# EAGLE design lmkbd (EAGLE 4.15)
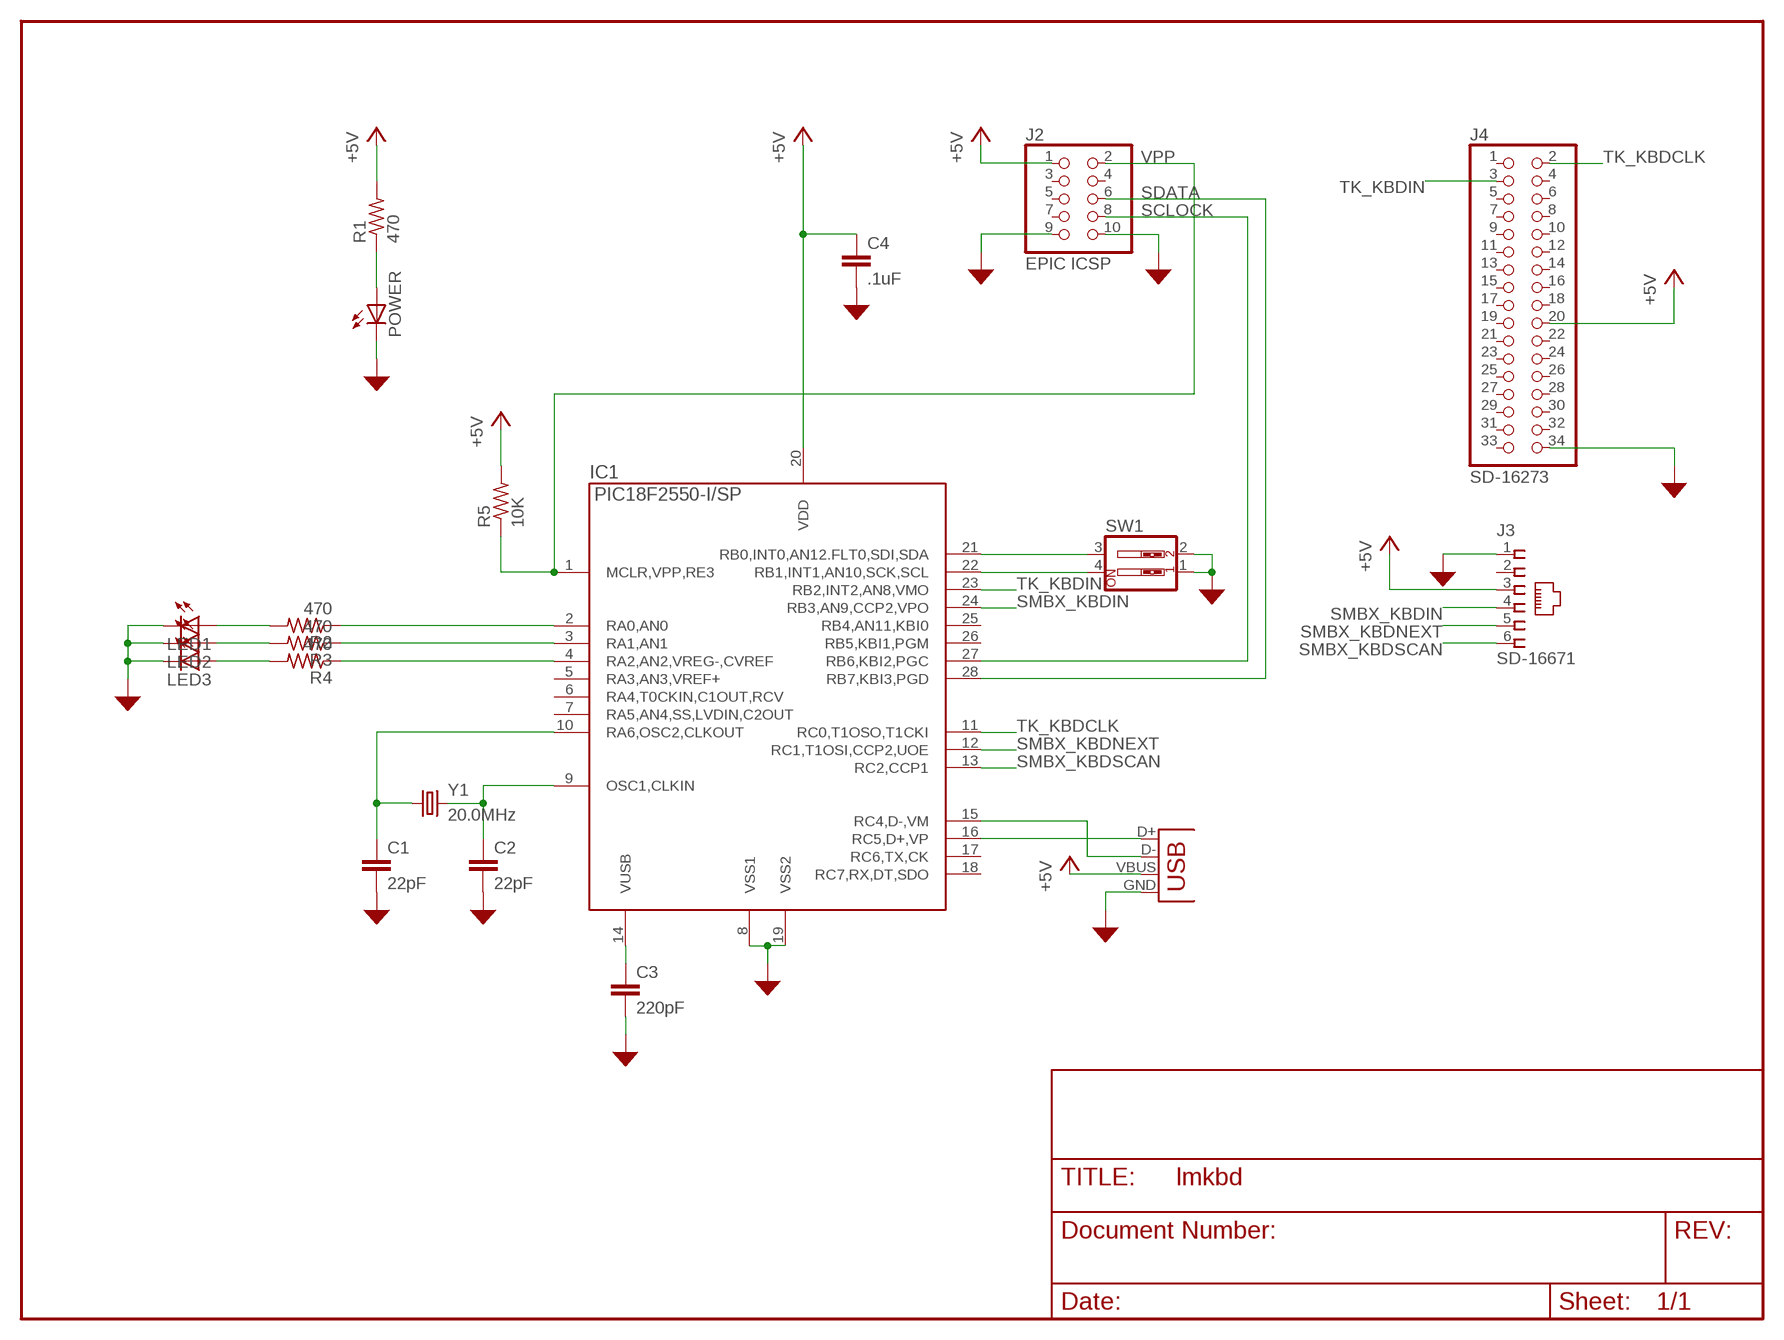
[diagram p0: schematic, sheet 1]

## Parts
C1  22pF  C-EU025-025X050  [C025-025X050]
C2  22pF  C-EU025-025X050  [C025-025X050]
C3  220pF  C-EU025-025X050  [C025-025X050]
C4  .1uF  C-EU025-025X050  [C025-025X050]
IC1  PIC18F2550-I/SP  [PDIP28]
J1  USB-B-H  [USB-B-H]
J2  EPIC ICSP  PINHD-2X5  [2X05]
J3  SD-16671  520243-3  [520243-3]
J4  SD-16273  PINHD-2X17  [2X17]
LED1  LED5MM  [LED5MM]
LED2  LED5MM  [LED5MM]
LED3  LED5MM  [LED5MM]
POWER  LED5MM  [LED5MM]
R1  470  R-US_0207/10  [0207/10]
R2  470  R-US_0207/10  [0207/10]
R3  470  R-US_0207/10  [0207/10]
R4  470  R-US_0207/10  [0207/10]
R5  10K  R-US_0207/10  [0207/10]
SW1  SW_DIP-2  [EDG-02]
Y1  20.0MHz  CRYTALHC49U-V  [HC49U-V]

## Nets
+5V: C4.1 IC1.20(VDD) J1.VBUS J2.1 J3.3 J4.20 R1.2 R5.2
GND: C1.2 C2.2 C3.2 C4.2 IC1.8(VSS1) IC1.19(VSS2) J1.GND J2.9 J2.10 J3.1 J4.34 LED1.K(C) LED2.K(C) LED3.K(C) POWER.K(C) SW1.1 SW1.2
LED1: IC1.2(RA0,AN0) R2.1
LED2: IC1.3(RA1,AN1) R3.1
LED3: IC1.4(RA2,AN2,VREG-,CVREF) R4.1
N$2: IC1.16(RC5,D+,VP) J1.D+
N$3: IC1.15(RC4,D-,VM) J1.D-
N$4: POWER.A R1.1
N$9: LED1.A R2.2
N$12: LED2.A R3.2
N$14: LED3.A R4.2
OSC1: C2.1 IC1.9(OSC1,CLKIN) Y1.2
OSC2: C1.1 IC1.10(RA6,OSC2,CLKOUT) Y1.1
SCLOCK: IC1.27(RB6,KBI2,PGC) J2.8
SDATA: IC1.28(RB7,KBI3,PGD) J2.6
SMBX_KBDIN: IC1.24(RB3,AN9,CCP2,VPO) J3.4
SMBX_KBDNEXT: IC1.12(RC1,T1OSI,CCP2,UOE) J3.5
SMBX_KBDSCAN: IC1.13(RC2,CCP1) J3.6
SW1: IC1.21(RB0,INT0,AN12.FLT0,SDI,SDA) SW1.3
SW2: IC1.22(RB1,INT1,AN10,SCK,SCL) SW1.4
TK_KBDCLK: IC1.11(RC0,T1OSO,T1CKI) J4.2
TK_KBDIN: IC1.23(RB2,INT2,AN8,VMO) J4.3
VPP: IC1.1(MCLR,VPP,RE3) J2.2 R5.1
VUSB: C3.1 IC1.14(VUSB)
Unconnected: IC1.5(RA3,AN3,VREF+) IC1.6(RA4,T0CKIN,C1OUT,RCV) IC1.7(RA5,AN4,SS,LVDIN,C2OUT) IC1.17(RC6,TX,CK) IC1.18(RC7,RX,DT,SDO) IC1.25(RB4,AN11,KBI0) IC1.26(RB5,KBI1,PGM) J2.3 J2.4 J2.5 J2.7 J3.2 J4.1 J4.4 J4.5 J4.6 J4.7 J4.8 J4.9 J4.10 J4.11 J4.12 J4.13 J4.14 J4.15 J4.16 J4.17 J4.18 J4.19 J4.21 J4.22 J4.23 J4.24 J4.25 J4.26 J4.27 J4.28 J4.29 J4.30 J4.31 J4.32 J4.33

## Library data of the parts
C1-C4 = rcl:C-EU: CAPACITOR, European symbol
IC1 = pic:PIC18F2550-*/?: 28 pins, 16Kw prog, 2K RAM, USB 12Mbit/S
J1 = con-usb:USB: USB Connectors
J2 = pinhead:PINHD-2X5: PIN HEADER
J3 = con-amp:520243-3: AMP connector
J4 = pinhead:PINHD-2X17: PIN HEADER
LED1-LED3 POWER = led:LED: LED OSRAM: - CHIPLED LG R971, LG N971, LY N971, LG Q971, LY Q971, LO R971, LY R971 LH N974, LH R974 LS Q976, LO Q976, LY Q976 LO Q996 - Hyper CHIPLED LW Q18S LB Q993, LB Q99A, LB R99A - SideLED LS A670, LO A670, LY A670, LG A670, LP A670 LB A673, LV A673, LT A673, LW A673 LH A674 LY A675 LS A676, LA A676, LO A676, LY A676, LW A676 LS A679, LY A679, LG A679 - Hyper Micro SIDELED® LS Y876, LA Y876, LO Y876, LY Y876 LT Y87S - SmartLED LW L88C, LW L88S LB L89C, LB L89S, LG L890 LS L89K, LO L89K, LY L89K LS L896, LA L896, LO L896, LY L896 - TOPLED LS T670, LO T670, LY T670, LG T670, LP T670 LSG T670, LSP T670, LSY T670, LOP T670, LYG T670 LG T671, LOG T671, LSG T671 LB T673, LV T673, LT T673, LW T673 LH T674 LS T676, LA T676, LO T676, LY T676, LB T676, LH T676, LSB T676, LW T676 LB T67C, LV T67C, LT T67C, LS T67K, LO T67K, LY T67K, LW E67C LS E67B, LA E67B, LO E67B, LY E67B, LB E67C, LV E67C, LT E67C LW T67C LS T679, LY T679, LG T679 LS T770, LO T770, LY T770, LG T770, LP T770 LB T773, LV T773, LT T773, LW T773 LH T774 LS E675, LA E675, LY E675, LS T675 LS T776, LA T776, LO T776, LY T776, LB T776 LHGB T686 LT T68C, LB T68C - Hyper Mini TOPLED® LB M676 - Mini TOPLED Santana® LG M470 LS M47K, LO M47K, LY M47K Source: http://www.osram.convergy.de/
R1-R5 = rcl:R-US_: RESISTOR, American symbol
SW1 = special:SW_DIP-2: DIP SWITCH
Y1 = crystal:CRYTAL: CRYSTAL

## Board
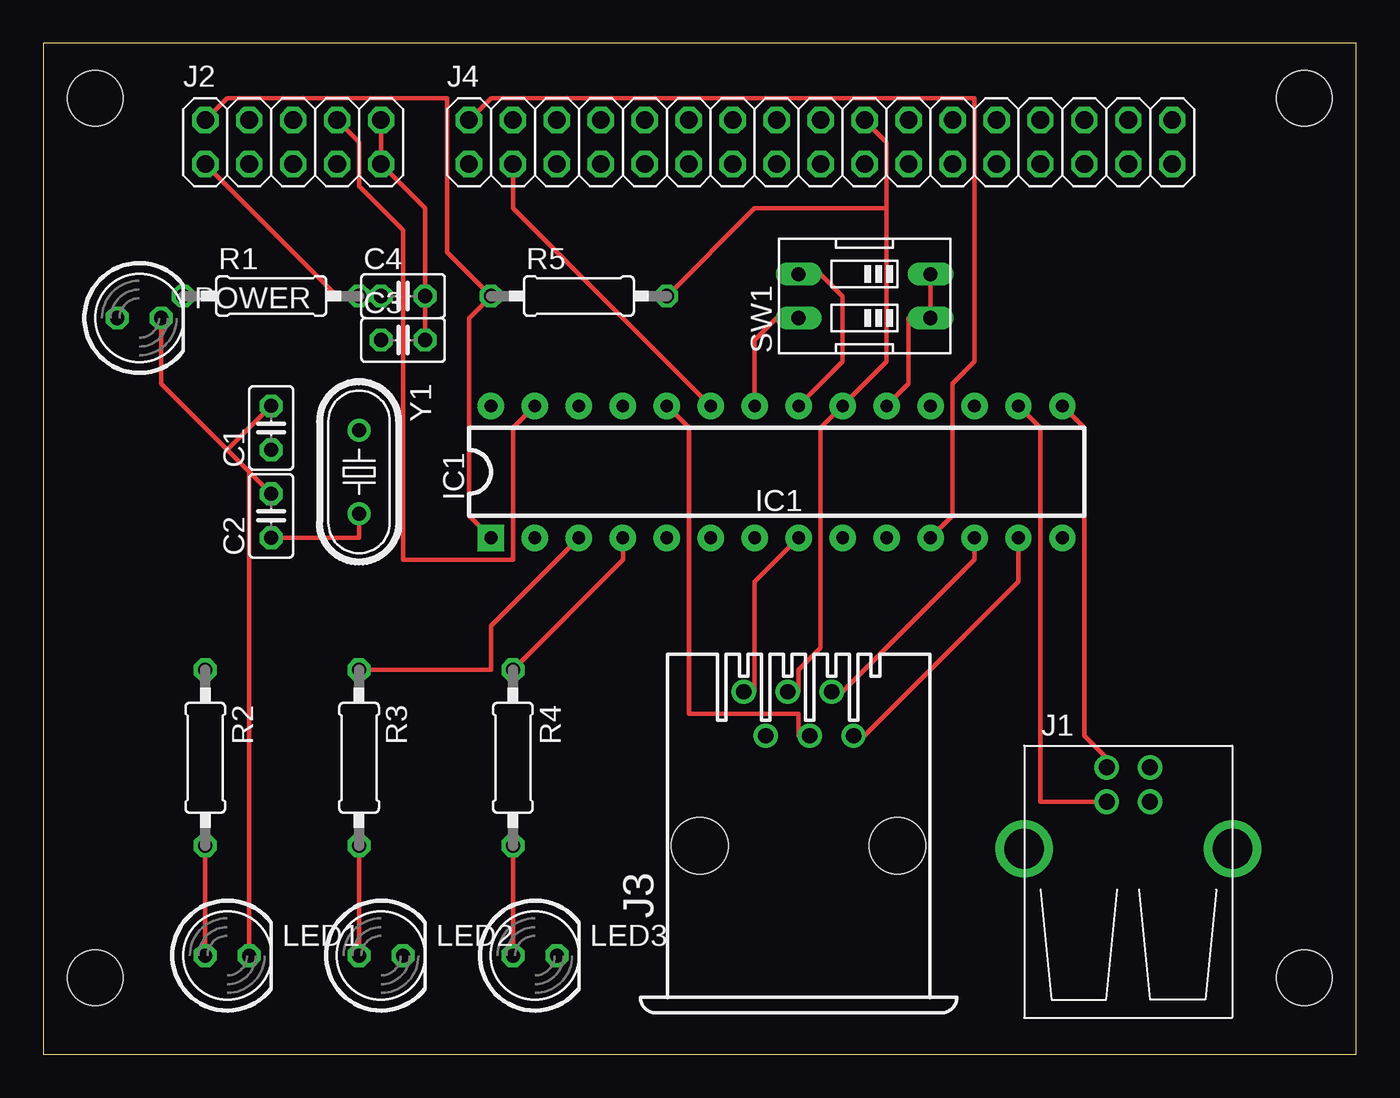
[diagram p1: board, top side]
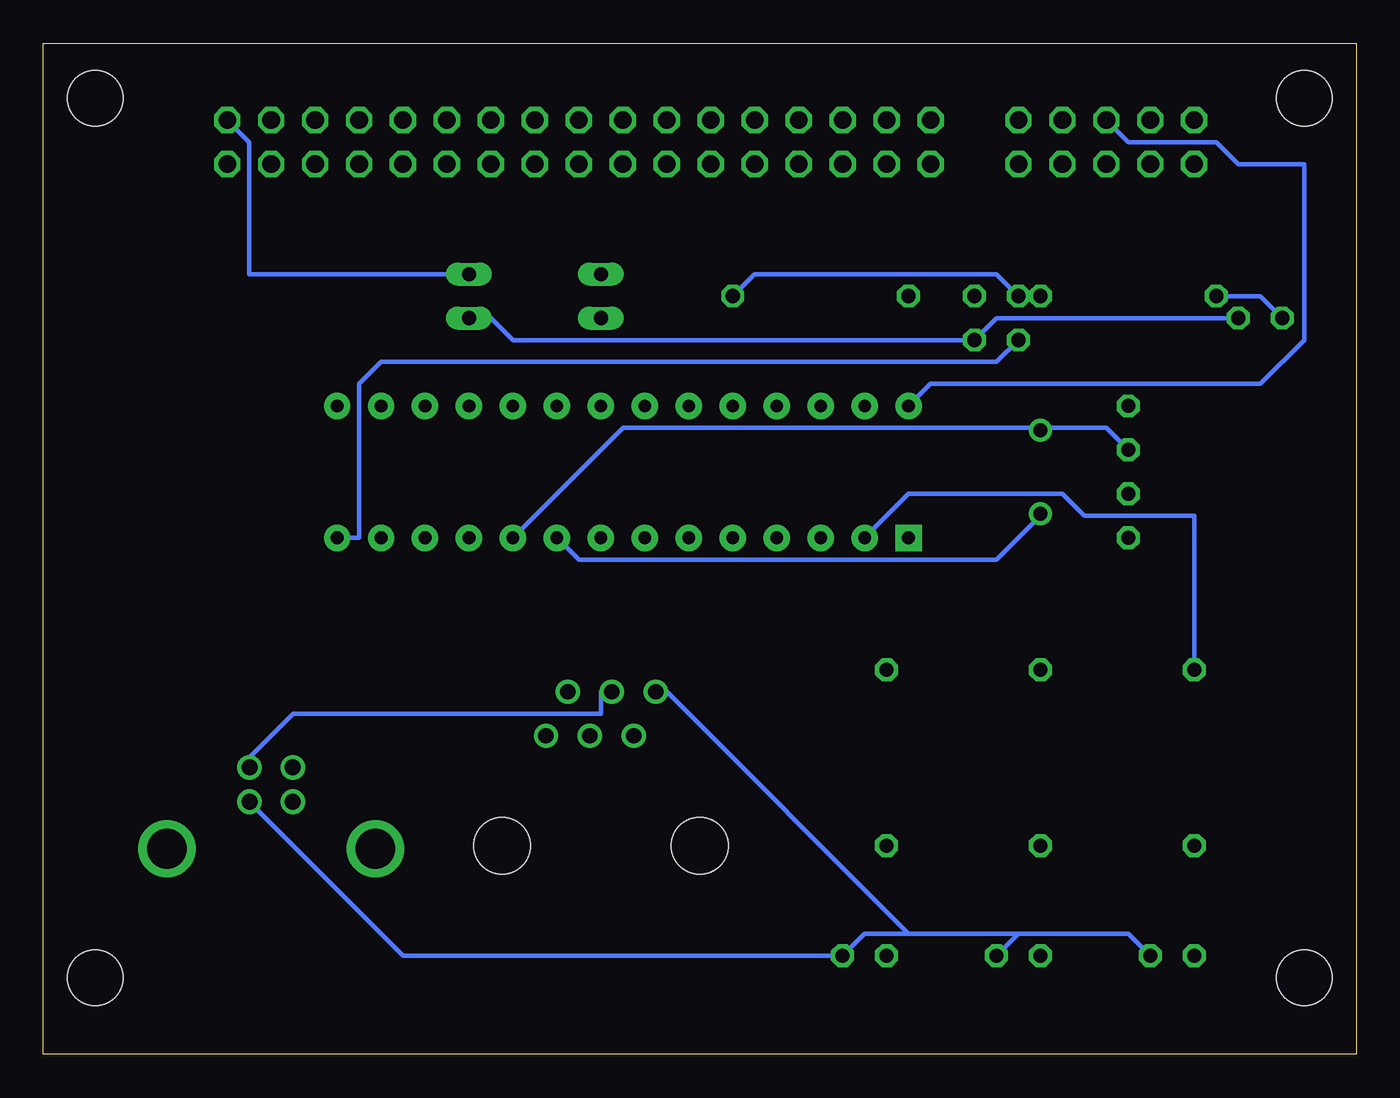
[diagram p2: board, bottom side, seen from below]

Size 75.87 x 58.41 mm. Coordinates in mm from the lower left corner, seen from the top.
Outline: 0,0 75.87,0 75.87,58.41 0,58.41 0,0
Copper layers (1*16): Top 0.035mm / dielectric 1.5mm / Bottom 0.035mm
Design rules "default": minimum track width 10mil, minimum drill 24mil, track to track 8mil, track to pad 8mil, pad to pad 8mil, via to via 8mil, smd to smd 8mil, copper to edge 40mil, drill to drill 8mil, minimum pad ring 10mil, minimum via ring 8mil, stop-mask expansion 4mil, vias tented up to drill 0mil, thermal gap 10mil
Holes 3.2 mm at 72.86,55.24 72.86,4.44 3.01,55.24 3.01,4.44

### Footprints (pad centres in the part's own frame; a part is rotated, then mirrored left to right if it is on the bottom)
C025-025X050 = drill 0.813 octagon: 1 -1.27,0; 2 1.27,0
PDIP28 = drill 0.737 pad 1.524 square: 1 -17.78,-3.81 | drill 0.737 pad 1.524 round: 2 -15.24,-3.81; 3 -12.7,-3.81; 4 -10.16,-3.81; 5 -7.62,-3.81; 6 -5.08,-3.81; 7 -2.54,-3.81; 8 0,-3.81; 9 2.54,-3.81; 10 5.08,-3.81; 11 7.62,-3.81; 12 10.16,-3.81; 13 12.7,-3.81; 14 15.24,-3.81; 15 15.24,3.81; 16 12.7,3.81; 17 10.16,3.81; 18 7.62,3.81; 19 5.08,3.81; 20 2.54,3.81; 21 0,3.81; 22 -2.54,3.81; 23 -5.08,3.81; 24 -7.62,3.81; 25 -10.16,3.81; 26 -12.7,3.81; 27 -15.24,3.81; 28 -17.78,3.81
USB-B-H = drill 0.914 round: D+ 0,1.25; D- 1.981,1.25; GND 0,-1.25; VBUS 1.981,-1.25 | drill 2.286 round: P$1 -2.718,-6.02; P$2 -2.718,6.02
2X05 = drill 1.016 octagon: 1 -5.08,-1.27; 2 -5.08,1.27; 3 -2.54,-1.27; 4 -2.54,1.27; 5 0,-1.27; 6 0,1.27; 7 2.54,-1.27; 8 2.54,1.27; 9 5.08,-1.27; 10 5.08,1.27
520243-3 = drill 0.889 round: 1 -3.175,8.89; 2 -1.905,6.35; 3 -0.635,8.89; 4 0.635,6.35; 5 1.905,8.89; 6 3.175,6.35 | hole 3.251: -5.715,0; 5.715,0
2X17 = drill 1.016 octagon: 1 -20.32,-1.27; 2 -20.32,1.27; 3 -17.78,-1.27; 4 -17.78,1.27; 5 -15.24,-1.27; 6 -15.24,1.27; 7 -12.7,-1.27; 8 -12.7,1.27; 9 -10.16,-1.27; 10 -10.16,1.27; 11 -7.62,-1.27; 12 -7.62,1.27; 13 -5.08,-1.27; 14 -5.08,1.27; 15 -2.54,-1.27; 16 -2.54,1.27; 17 0,-1.27; 18 0,1.27; 19 2.54,-1.27; 20 2.54,1.27; 21 5.08,-1.27; 22 5.08,1.27; 23 7.62,-1.27; 24 7.62,1.27; 25 10.16,-1.27; 26 10.16,1.27; 27 12.7,-1.27; 28 12.7,1.27; 29 15.24,-1.27; 30 15.24,1.27; 31 17.78,-1.27; 32 17.78,1.27; 33 20.32,-1.27; 34 20.32,1.27
LED5MM = drill 0.813 octagon: A -1.27,0; K 1.27,0
0207/10 = drill 0.813 octagon: 1 -5.08,0; 2 5.08,0
EDG-02 = drill 0.813 long: 1 -1.27,-3.81; 2 1.27,-3.81; 3 1.27,3.81; 4 -1.27,3.81
HC49U-V = drill 0.813 round: 1 -2.413,0; 2 2.413,0

### Placement (x,y rotation side)
C1  13.17,36.19 90 top
C2  13.17,31.11 90 top
C3  20.79,41.27 0 top
C4  20.79,43.81 0 top
IC1  43.65,33.65 0 top
J1  62.7,14.6 90 top
J2  14.44,52.7 0 top
J3  43.65,12.06 0 top
J4  44.92,52.7 0 top
LED1  10.63,5.71 0 top
LED2  19.52,5.71 0 top
LED3  28.41,5.71 0 top
POWER  5.55,42.54 0 top
R1  13.17,43.81 0 top
R2  9.36,17.14 270 top
R3  18.25,17.14 270 top
R4  27.14,17.14 270 top
R5  30.95,43.81 0 top
SW1  47.46,43.81 90 top
Y1  18.25,33.65 270 top

### Tracks (layer width: path | path; a pad name or v marks a point on that pad's centre or on a via)
+5V
  Top 0.254: C4.1 R1.2 16.98,43.81 J2.1 | J3.3 43.65,20.95 43.65,22.22 44.92,23.49 44.92,36.19 IC1.20 48.73,40 48.73,48.89 | J4.20 48.73,52.7 48.73,48.89 | R5.2 41.11,48.89 48.73,48.89
  Bottom 0.254: R5.2 34.76,45.08 20.79,45.08 C4.1 | J3.3 43.65,20.95 43.65,19.68 61.43,19.68 63.97,17.14 J1.VBUS
GND
  Top 0.254: IC1.8 41.11,27.3 41.11,20.95 J3.1 | SW1.2 SW1.1 50,42.54 50,38.73 IC1.19 | J2.10 J2.9 22.06,48.89 C4.2 C3.2 | 10.63,34.92 6.82,38.73 POWER.K | 11.9,33.65 10.63,34.92 | 11.9,33.65 C2.2 | 10.63,34.92 C1.2 | LED1.K 11.9,33.65
  Bottom 0.254: LED1.K 13.17,6.98 19.52,6.98 | 19.52,6.98 LED2.K | 19.52,6.98 25.87,6.98 | 25.87,6.98 28.41,6.98 LED3.K 55.08,5.71 63.97,14.6 J1.GND | 25.87,6.98 39.84,20.95 J3.1 | J4.34 63.97,52.7 63.97,45.08 SW1.2 | POWER.K 20.79,42.54 C3.2 48.73,41.27 50,42.54 SW1.1
LED1
  Bottom 0.254: R2.1 9.36,31.11 15.71,31.11 16.98,32.38 25.87,32.38 IC1.2
LED2
  Top 0.254: R3.1 25.87,22.22 25.87,24.76 IC1.3
LED3
  Top 0.254: R4.1 33.49,28.57 IC1.4
N$2
  Top 0.254: IC1.16 57.62,36.19 57.62,14.6 J1.D+
N$3
  Top 0.254: IC1.15 60.16,36.19 60.16,18.41 61.43,17.14 J1.D-
N$4
  Bottom 0.254: POWER.A 5.55,43.81 R1.1
N$9
  Top 0.254: LED1.A R2.2
N$12
  Top 0.254: LED2.A R3.2
N$14
  Top 0.254: LED3.A R4.2
OSC1
  Top 0.254: C2.1 18.25,29.84 Y1.2
  Bottom 0.254: IC1.9 44.92,28.57 20.79,28.57 18.25,31.11 Y1.2
OSC2
  Bottom 0.254: C1.1 14.44,36.19 18.25,36.19 | IC1.10 42.38,36.19 18.25,36.19 | 18.25,36.19 Y1.1
SCLOCK
  Top 0.254: IC1.27 27.14,36.19 27.14,28.57 20.79,28.57 20.79,47.62 18.25,50.16 18.25,52.7 J2.8
SDATA
  Bottom 0.254: IC1.28 24.6,38.73 5.55,38.73 3.01,41.27 3.01,51.43 6.82,51.43 8.09,52.7 13.17,52.7 J2.6
SMBX_KBDIN
  Top 0.254: IC1.24 37.3,36.19 37.3,19.68 43.65,19.68 43.65,18.41 J3.4
SMBX_KBDNEXT
  Top 0.254: IC1.12 53.81,28.57 46.19,20.95 J3.5
SMBX_KBDSCAN
  Top 0.254: IC1.13 56.35,27.3 47.46,18.41 J3.6
SW1
  Top 0.254: IC1.21 46.19,40 46.19,43.81 44.92,45.08 SW1.3
SW2
  Top 0.254: IC1.22 41.11,41.27 42.38,42.54 SW1.4
TK_KBDCLK
  Top 0.254: J4.2 25.87,55.24 53.81,55.24 53.81,40 52.54,38.73 52.54,31.11 IC1.11
TK_KBDIN
  Top 0.254: IC1.23 27.14,48.89 J4.3
VPP
  Top 0.254: IC1.1 24.6,31.11 24.6,42.54 R5.1 23.33,46.35 23.33,55.24 10.63,55.24 J2.2
VUSB
  Bottom 0.254: C3.1 20.79,40 56.35,40 57.62,38.73 57.62,29.84 IC1.14